# Altium schematic sheet part_1_2020-12-24_12-20-03.schdoc
size 309 x 219 mm
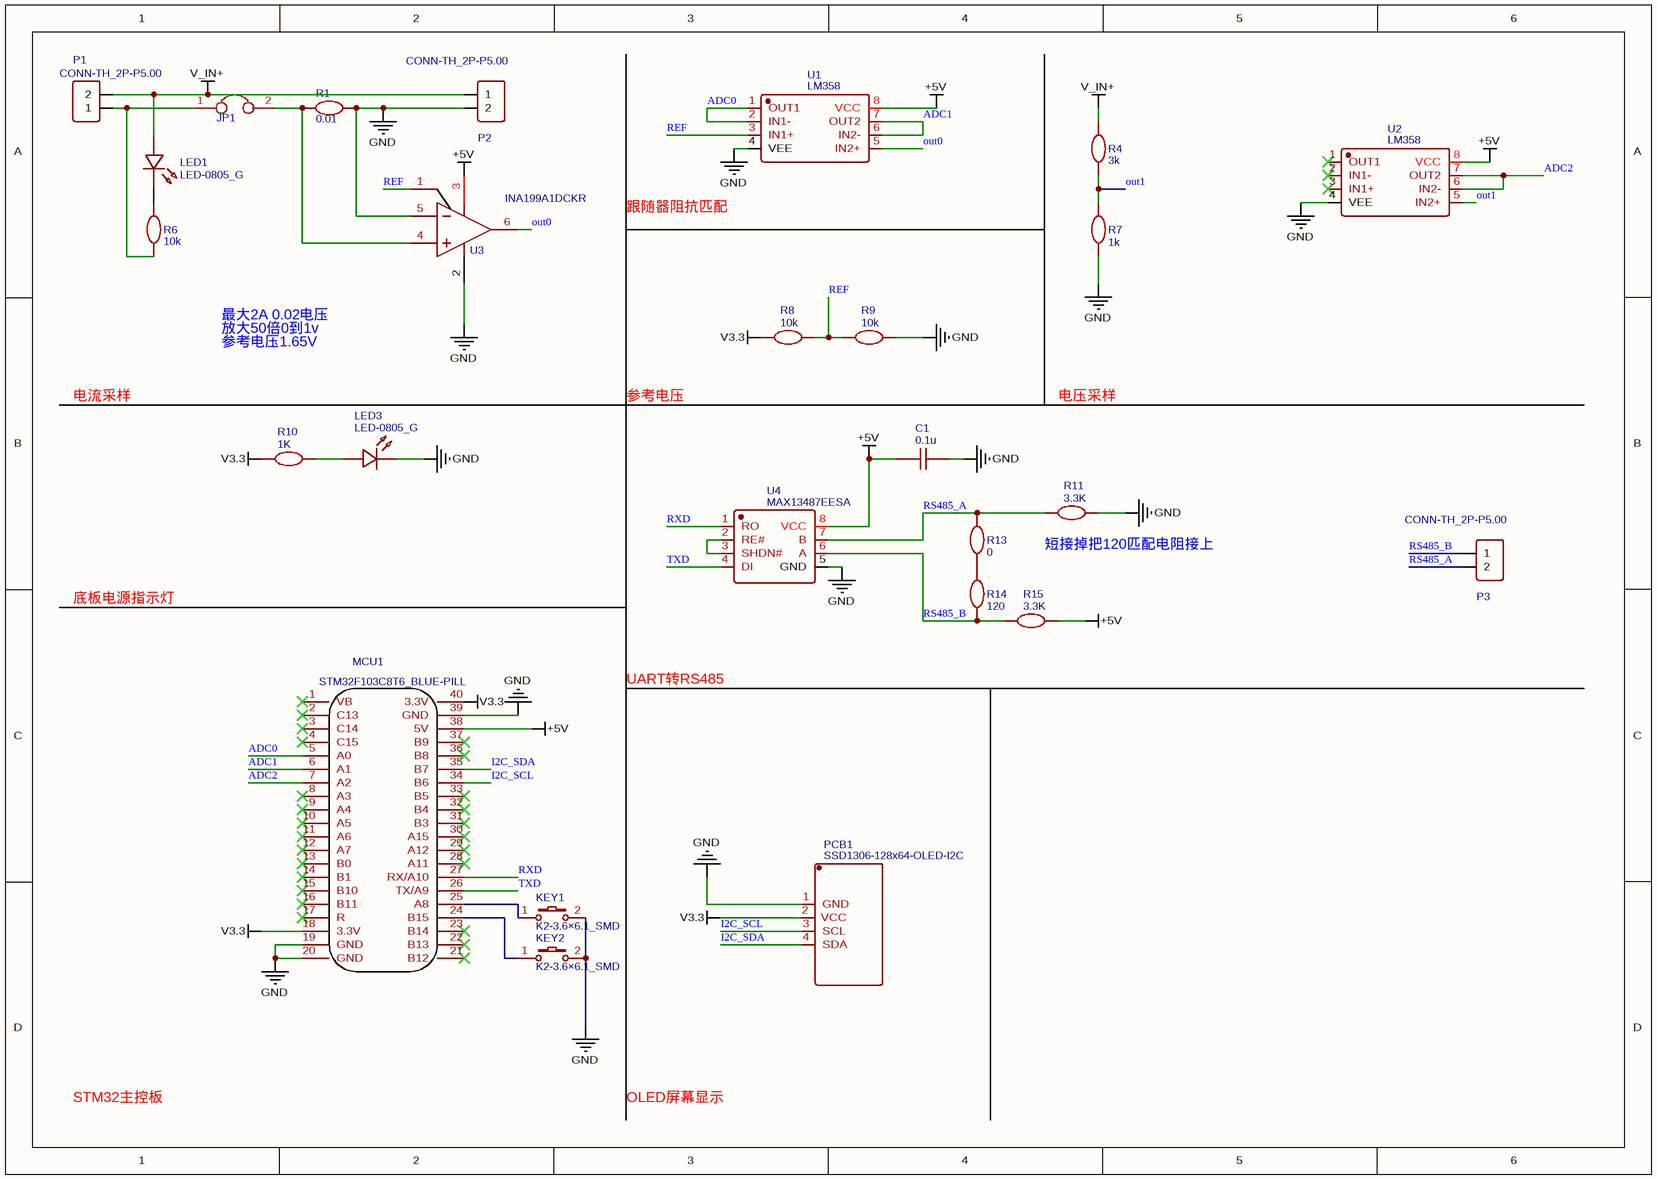
[diagram p0: part_1_2020-12-24_12-20-03.schdoc]

## Parts
C1  0.1u  [C0805]
JP1  JUMPER  [HDR-F-2.54_1X2]  (value not drawn)
KEY1  K2-3.6×6.1_SMD  [KEY-SMD_2P-L6.2-W3.6-LS8.0]
KEY2  K2-3.6×6.1_SMD  [KEY-SMD_2P-L6.2-W3.6-LS8.0]
LED1  LED-0805_G  [LED0805_GREEN]
LED3  LED-0805_G  [LED0805_GREEN]
MCU1  STM32F103C8T6_BLUE-PILL  [STM32F103C8T6_BLUE-PILL]
P1  CONN-TH_2P-P5.00  [CONN-TH_2P-P5.00]
P2  CONN-TH_2P-P5.00  [CONN-TH_2P-P5.00]
P3  CONN-TH_2P-P5.00  [CONN-TH_2P-P5.00]
PCB1  SSD1306-128x64-OLED-I2C  [SSD1306_GNDVCC]
R1  0.01  [R2512]
R4  3k  [C0805]
R6  10k  [R0805]
R7  1k  [C0805]
R8  10k  [C0805]
R9  10k  [C0805]
R10  1K  [R0805]
R11  3.3K  [R0805]
R13  0  [R0805]
R14  120  [R0805]
R15  3.3K  [R0805]
U1  LM358  [SOP-8_L4.9-W3.9-P1.27-LS6.0-BL]
U2  LM358  [SOP-8_L4.9-W3.9-P1.27-LS6.0-BL]
U3  INA199A1DCKR  [SOT-363_L2.0-W1.3-P0.65-LS2.1-BR]
U4  MAX13487EESA  [SOIC-8_L4.9-W3.9-P1.27-LS6.0-BL]

## Nets
+5V: C1.2 MCU1.38(5V) R15.2 U1.8(VCC) U2.8(VCC) U3.3(V+) U4.8(VCC)
GND: C1.1 KEY1.2 KEY2.2 LED3.2 MCU1.19(GND) MCU1.20(GND) MCU1.39(GND) P2.2 PCB1.1(GND) R1.1 R7.1 R9.1 R11.1 U1.4(VEE) U2.4(VEE) U3.2(GND) U3.5(IN-) U4.5(GND)
V3.3: MCU1.18(3.3V) MCU1.40(3.3V) PCB1.2(VCC) R8.2 R10.2
V_IN+: LED1.1 P1.2 P2.1 R4.2
ADC0: MCU1.5(A0) U1.1(OUT1) U1.2(IN1-)
ADC1: MCU1.6(A1) U1.6(IN2-) U1.7(OUT2)
ADC2: MCU1.7(A2) U2.6(IN2-) U2.7(OUT2)
I2C_SCL: MCU1.34(B6) PCB1.3(SCL)
I2C_SDA: MCU1.35(B7) PCB1.4(SDA)
out0: U1.5(IN2+) U3.6(OUT)
out1: R4.1 R7.2 U2.5(IN2+)
REF: R8.1 R9.2 U1.3(IN1+) U3.1(REF)
RS485_A: P3.2 R11.2 R13.2 U4.7(B)
RS485_B: P3.1 R14.1 R15.1 U4.6(A)
RXD: MCU1.27(RX/A10) U4.1(RO)
TXD: MCU1.26(TX/A9) U4.4(DI)
NetJP1_1: JP1.1 P1.1 R6.1
NetJP1_2: JP1.2 R1.2 U3.4(IN+)
NetKEY1_1: KEY1.1 MCU1.25(A8)
NetKEY2_1: KEY2.1 MCU1.24(B15)
NetLED1_2: LED1.2 R6.2
NetLED3_1: LED3.1 R10.1
NetR13_1: R13.1 R14.2
NetU4_2: U4.2(RE#) U4.3(SHDN#)

Not connected (* = marked no-connect by the designer): MCU1 1(VB)* 2(C13)* 3(C14)* 4(C15)* 8(A3)* 9(A4)* 10(A5)* 11(A6)* 12(A7)* 13(B0)* 14(B1)* 15(B10)* 16(B11)* 17(R)* 21(B12)* 22(B13)* 23(B14)* 28(A11)* 29(A12)* 30(A15)* 31(B3)* 32(B4)* 33(B5)* 36(B8)* 37(B9)*; U2 1(OUT1)* 2(IN1-)* 3(IN1+)*

## Notes on the sheet
- 跟随器阻抗匹配
- 最大2A 0.02电压
- 放大50倍0到1v
- 参考电压1.65V
- 电流采样
- 参考电压
- 电压采样
- (near R11) 短接掉把120匹配电阻接上
- 底板电源指示灯
- UART转RS485
- STM32主控板
- OLED屏幕显示

## Library data of the parts
C1 = 0.1u: nameAlias: Value(F); Contributor: LCEDA_Lib; spicePre: C; spiceSymbolName: C_0805_US
KEY1 KEY2 = K2-3.6×6.1_SMD: BOM_Manufacturer Part: K2-1107ST-A4SW-06; Contributor: LCEDA_Lib; 制造商: 韩国韩荣; BOM_Supplier Part: C118141; BOM_Supplier: LCSC; spicePre: K; spiceSymbolName: K2-3.6×6.1_SMD
LED1 LED3 = LED-0805_G: BOM_Manufacturer: EVERLIGHT(台湾亿光); BOM_Manufacturer Part: 19-217/GHC-YR1S2/3T; Contributor: LCEDA_Lib; BOM_Supplier Part: C72043; BOM_Supplier: LCSC; spicePre: L; spiceSymbolName: LED-0603_G
MCU1 = STM32F103C8T6_BLUE-PILL: Contributor: lzbsuzhou; spicePre: M; spiceSymbolName: STM32F103C8T6_BLUE-PILL
P1-P3 = CONN-TH_2P-P5.00: Contributor: LCEDA_Lib; BOM_Supplier: LCSC; spicePre: P; spiceSymbolName: CONN-TH_2P-P5.00
PCB1 = SSD1306-128x64-OLED-I2C: sourceId: wICUcuL3l; spicePre: X; timeStamp: 1456014235; spiceSymbolName: SSD1306-128x64-OLED-I2C
R1 = 0.01: nameAlias: Value(Ω); Contributor: LCEDA_Lib; spicePre: R; spiceSymbolName: R_2512_EU
R4 = 3k: nameAlias: Value(Ω); Contributor: LCEDA_Lib; spicePre: R; spiceSymbolName: R_2512_EU
R6 R8 R9 = 10k: nameAlias: Value(Ω); Contributor: LCEDA_Lib; spicePre: R; spiceSymbolName: R_2512_EU
R7 = 1k: nameAlias: Value(Ω); Contributor: LCEDA_Lib; spicePre: R; spiceSymbolName: R_2512_EU
R10 = 1K: nameAlias: Value(Ω); Contributor: LCEDA_Lib; spicePre: R; spiceSymbolName: R_2512_EU
R11 R15 = 3.3K: nameAlias: Value(Ω); Contributor: LCEDA_Lib; spicePre: R; spiceSymbolName: R_0805_EU
R13 = 0: nameAlias: Value(Ω); Contributor: LCEDA_Lib; spicePre: R; spiceSymbolName: R_0805_EU
R14 = 120: nameAlias: Value(Ω); Contributor: LCEDA_Lib; spicePre: R; spiceSymbolName: R_0805_EU
U1 U2 = LM358: BOM_Manufacturer: BLUE ROCKET; Contributor: LCSC; SMT Type: Extend; BOM_Supplier: LCSC; BOM_Supplier Part: C328566; BOM_Manufacturer Part: LM358; BOM_JLCPCB SMD: Yes; spicePre: U; spiceSymbolName: LM358
U3 = INA199A1DCKR: BOM_Manufacturer: Texas Instruments; BOM_Manufacturer Part: INA199A3DCKR; Contributor: LCSC; SMT Type: Extend; BOM_Supplier: LCSC; BOM_Supplier Part: C132098; BOM_JLCPCB SMD: Yes; spicePre: U; spiceSymbolName: INA199A3DCKR
U4 = MAX13487EESA: BOM_Manufacturer: MAXIM; SMT Type: Extend; BOM_Supplier: LCSC; BOM_Manufacturer Part: MAX13487EESA; image: //image.lceda.cn/szlcsc/C18347.jpg; BOM_Supplier Part: C18347; BOM_LCSC Assembly: Yes; spicePre: U; spiceSymbolName: MAX13487EESA
JP1 = JUMPER: spicePre: J; spiceSymbolName: JUMPER